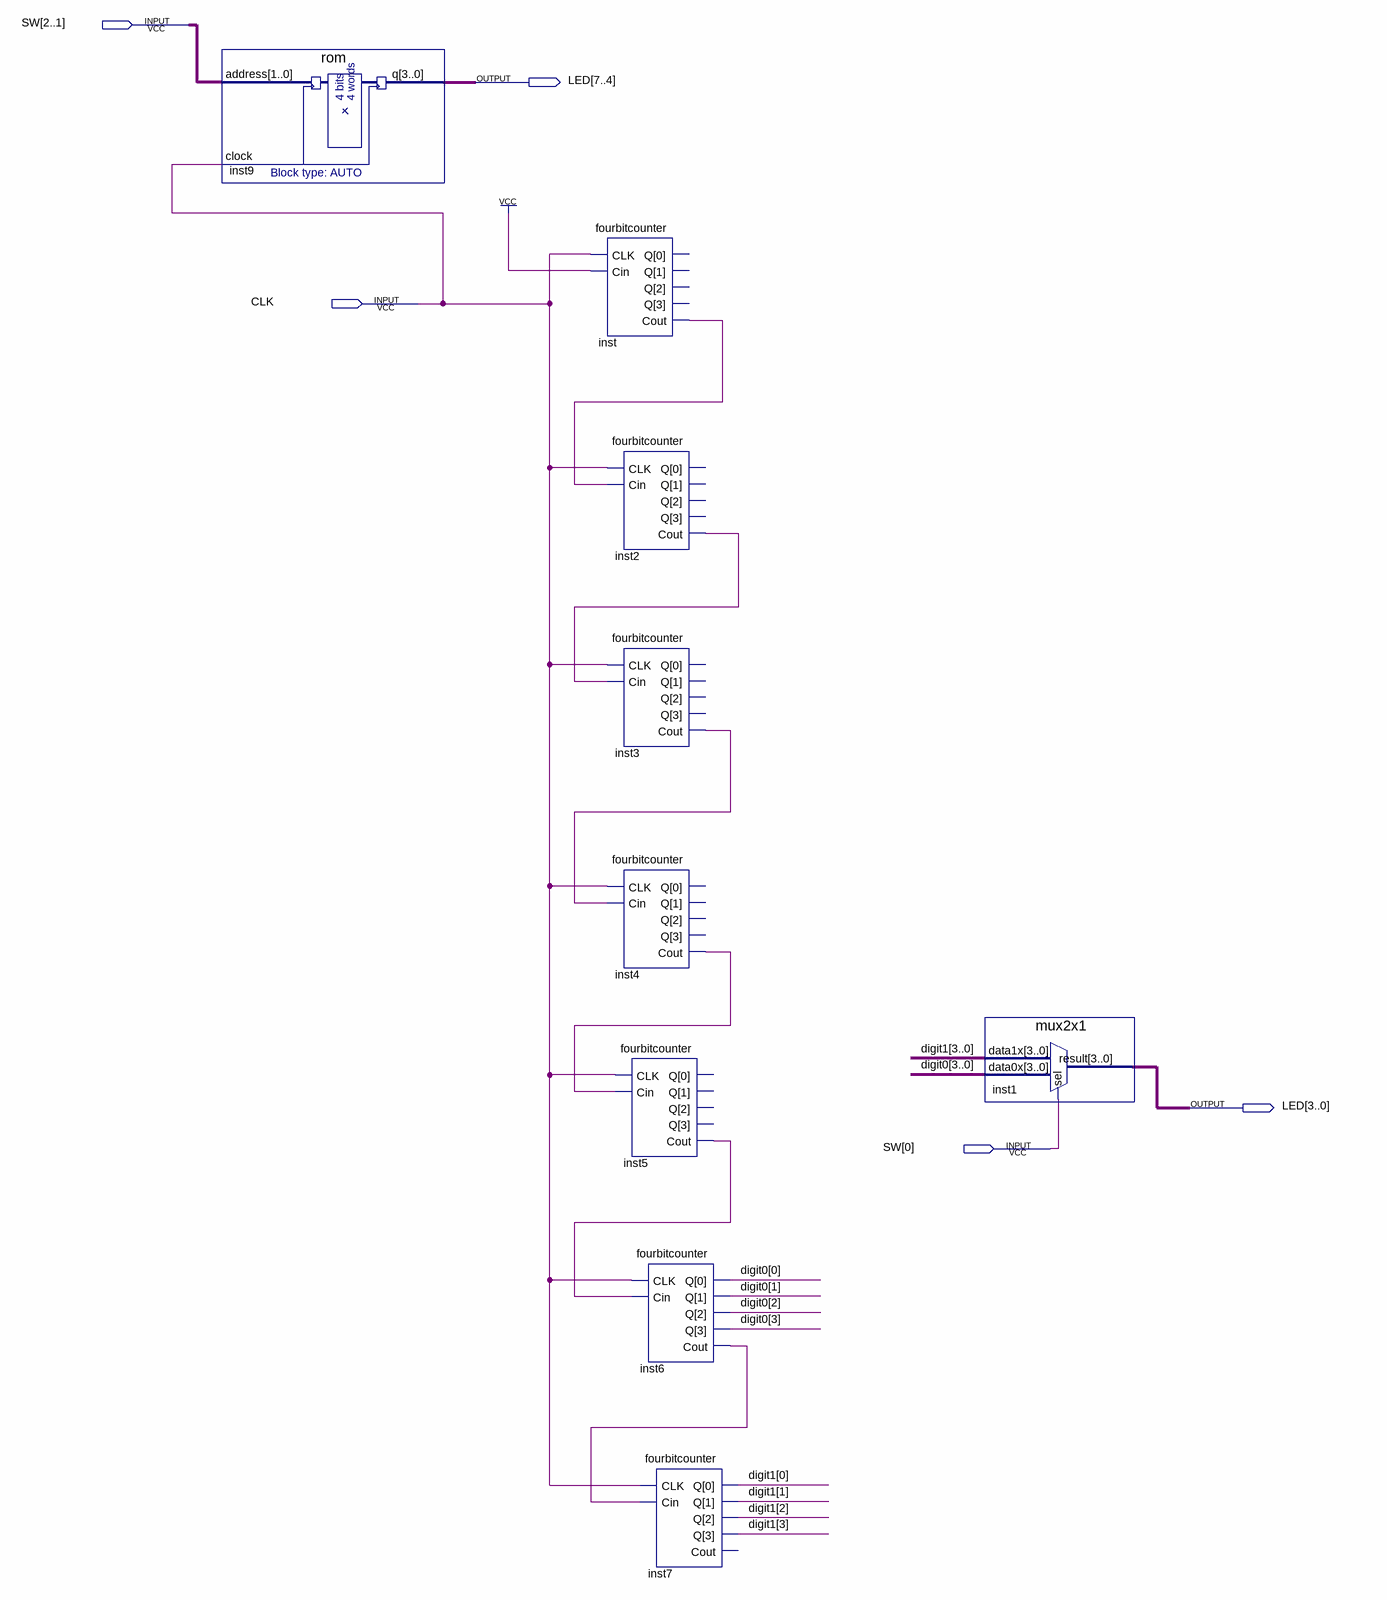
[diagram p0: schematic sheet]
// Quartus schematic sematik3_top.bdf as structural Verilog: 9 symbols, 5 pins
module sematik3_top (
  input  [2:0] SW,
  input  CLK,
  output [7:0] LED
);

  wire inst2_cout, inst3_cout, inst4_cout, inst5_cout, inst6_cout, inst_cout;
  wire [3:0] digit0, digit1;

  rom inst9 (.address(SW[2:1]), .clock(CLK), .q(LED[7:4]));
  fourbitcounter inst (.CLK(CLK), .Cin(1'b1), .Cout(inst_cout));  // open: Q
  fourbitcounter inst2 (.CLK(CLK), .Cin(inst_cout), .Cout(inst2_cout));  // open: Q
  fourbitcounter inst3 (.CLK(CLK), .Cin(inst2_cout), .Cout(inst3_cout));  // open: Q
  fourbitcounter inst4 (.CLK(CLK), .Cin(inst3_cout), .Cout(inst4_cout));  // open: Q
  fourbitcounter inst5 (.CLK(CLK), .Cin(inst4_cout), .Cout(inst5_cout));  // open: Q
  fourbitcounter inst6 (.CLK(CLK), .Cin(inst5_cout), .Q(digit0), .Cout(inst6_cout));
  fourbitcounter inst7 (.CLK(CLK), .Cin(inst6_cout), .Q(digit1));  // open: Cout
  mux2x1 inst1 (.data1x(digit1), .data0x(digit0), .sel(SW[0]), .result(LED[3:0]));
endmodule
